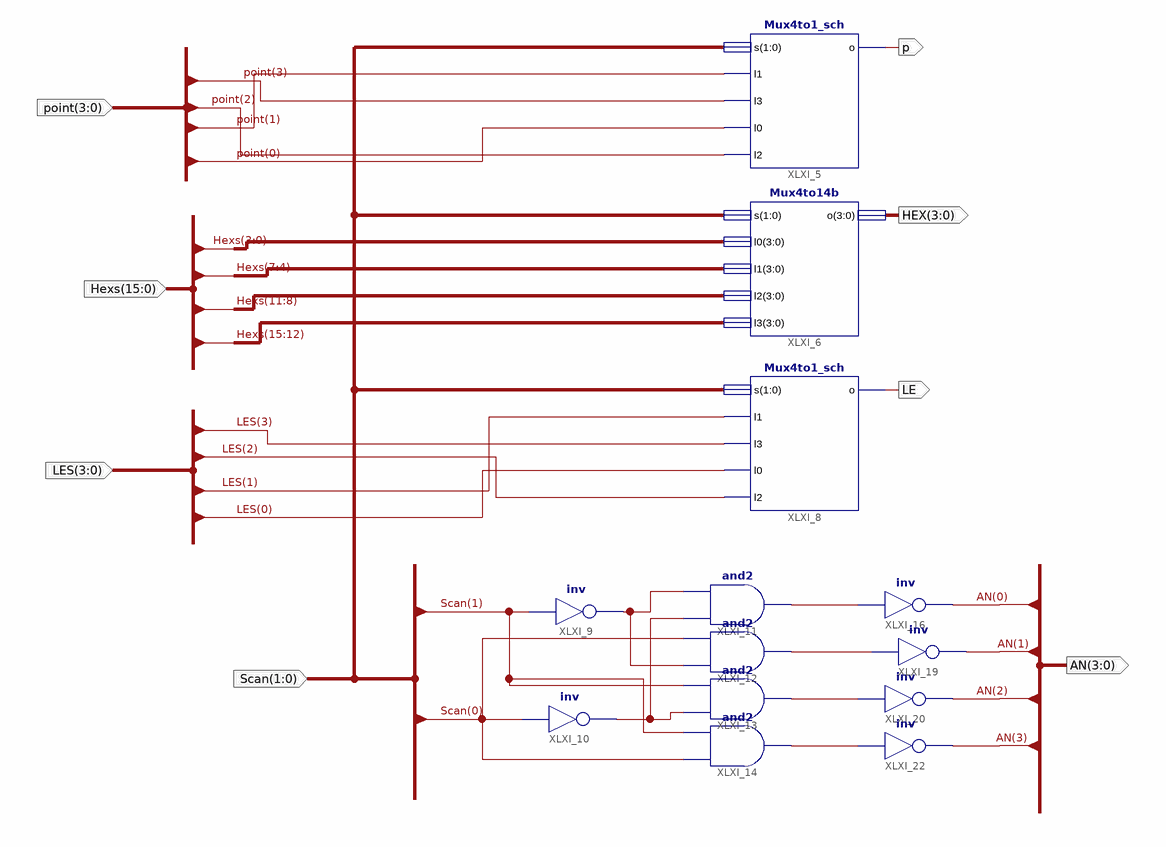
[diagram p0: schematic sheet 1]
// Xilinx ISE schematic DisplaySync_sch.sch (kintex7) as structural Verilog: 13 symbols, 8 ports
module DisplaySync_sch (
  input  [1:0] Scan,
  input  [15:0] Hexs,
  input  [3:0] point,
  input  [3:0] LES,
  output [3:0] AN,
  output p,
  output LE,
  output [3:0] HEX
);

  wire XLXN_7, XLXN_8, XLXN_9, XLXN_10, XLXN_16, XLXN_19;

  Mux4to1_sch XLXI_5 (.s(Scan), .l1(point[1]), .l3(point[3]), .l0(point[0]), .l2(point[2]), .o(p));
  Mux4to14b XLXI_6 (.s(Scan), .l0(Hexs[3:0]), .l1(Hexs[7:4]), .l2(Hexs[11:8]), .l3(Hexs[15:12]), .o(HEX));
  Mux4to1_sch XLXI_8 (.s(Scan), .l1(LES[1]), .l3(LES[3]), .l0(LES[0]), .l2(LES[2]), .o(LE));
  not XLXI_9 (XLXN_16, Scan[1]);
  not XLXI_10 (XLXN_19, Scan[0]);
  and XLXI_11 (XLXN_7, XLXN_19, XLXN_16);
  and XLXI_12 (XLXN_8, XLXN_16, Scan[0]);
  and XLXI_13 (XLXN_9, XLXN_19, Scan[1]);
  and XLXI_14 (XLXN_10, Scan[0], Scan[1]);
  not XLXI_16 (AN[0], XLXN_7);
  not XLXI_19 (AN[1], XLXN_8);
  not XLXI_20 (AN[2], XLXN_9);
  not XLXI_22 (AN[3], XLXN_10);
endmodule
